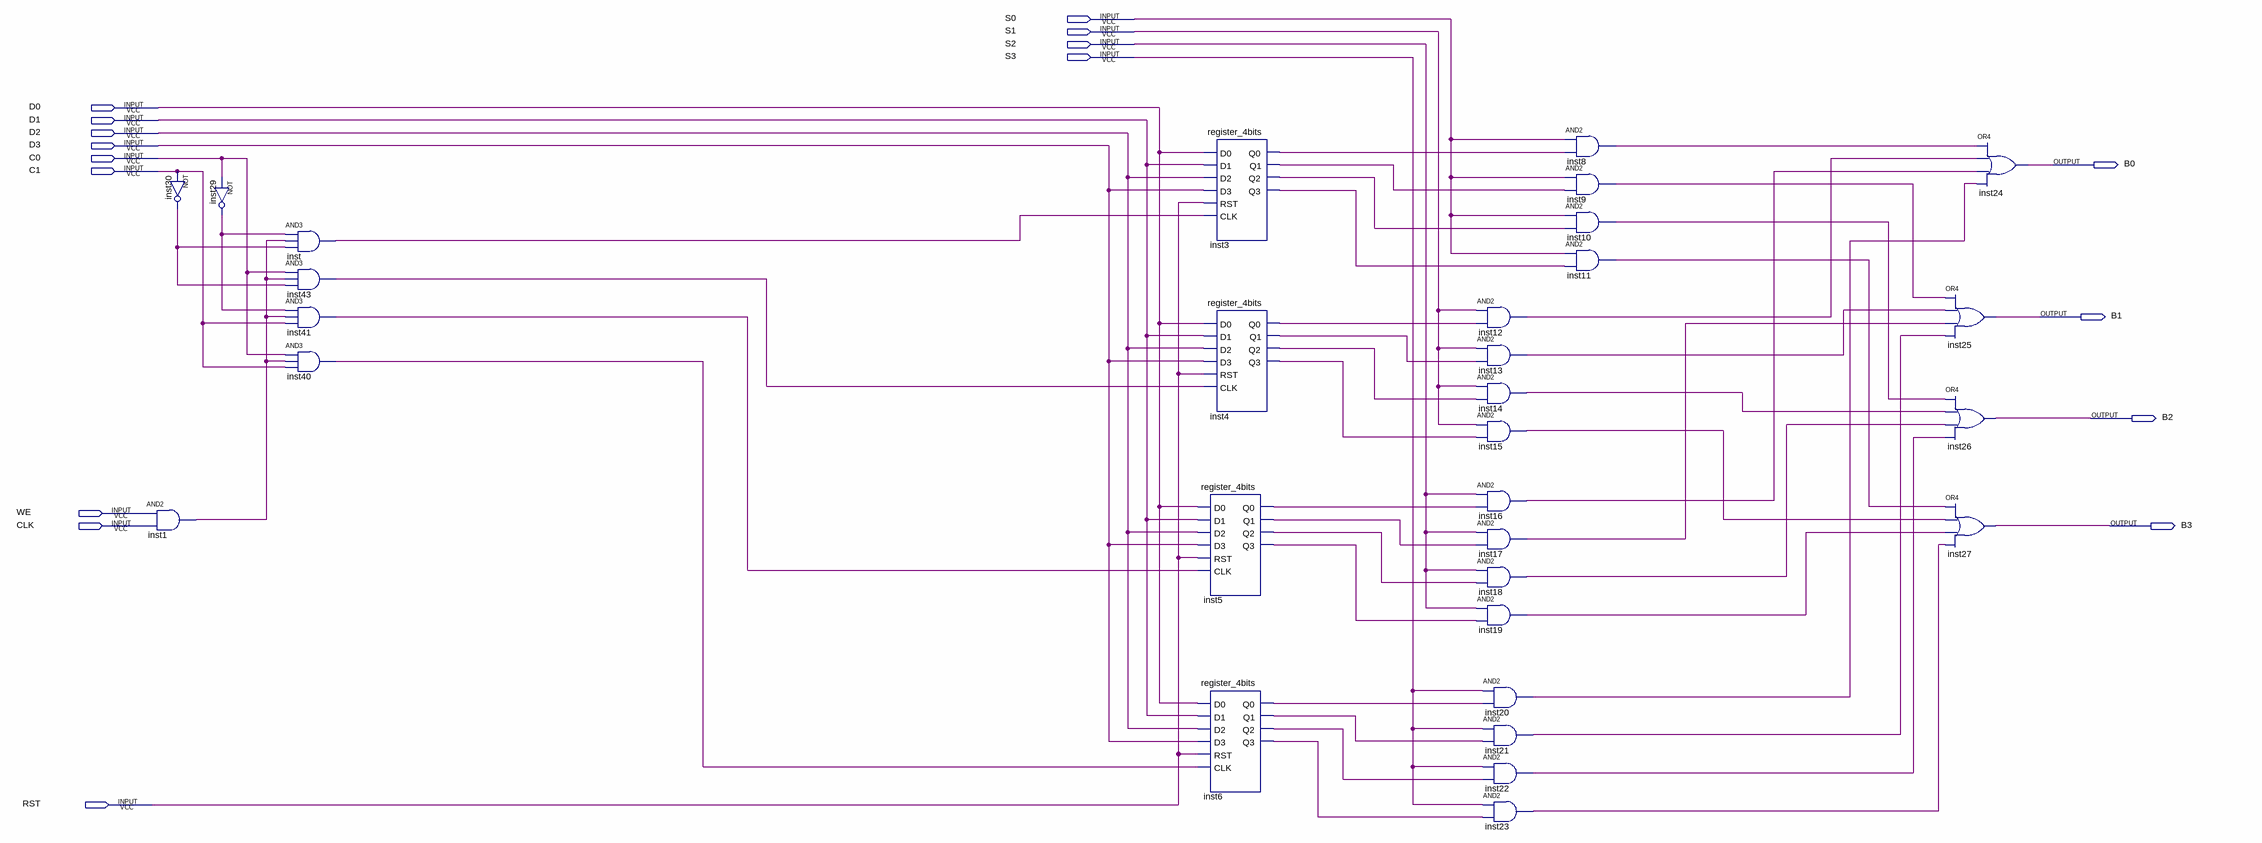
[diagram p0: schematic sheet]
// Quartus schematic register_bank.bdf as structural Verilog: 31 symbols, 17 pins
module register_bank (
  input  S0,
  input  S1,
  input  S2,
  input  S3,
  input  D0,
  input  D1,
  input  D2,
  input  D3,
  input  C0,
  input  C1,
  input  WE,
  input  CLK,
  input  RST,
  output B0,
  output B1,
  output B2,
  output B3
);

  wire inst1_out, inst3_q0, inst3_q1, inst3_q2, inst3_q3, inst4_q0, inst4_q1, inst4_q2, inst4_q3, inst5_q0,
       inst5_q1, inst5_q2, inst5_q3, inst6_q0, inst6_q1, inst6_q2, inst6_q3, inst8_out, inst9_out,
       inst10_out, inst11_out, inst12_out, inst13_out, inst14_out, inst15_out, inst16_out, inst17_out,
       inst18_out, inst19_out, inst20_out, inst21_out, inst22_out, inst23_out, inst29_out, inst30_out,
       inst40_out, inst41_out, inst43_out, inst_out;

  not inst30 (inst30_out, C1);
  and inst1 (inst1_out, WE, CLK);
  not inst29 (inst29_out, C0);
  and inst (inst_out, inst29_out, inst1_out, inst30_out);
  and inst43 (inst43_out, C0, inst1_out, inst30_out);
  and inst41 (inst41_out, inst29_out, inst1_out, C1);
  and inst40 (inst40_out, C0, inst1_out, C1);
  register_4bits inst3 (
    .D0(D0), .D1(D1), .D2(D2), .D3(D3), .RST(RST), .CLK(inst_out), .Q0(inst3_q0), .Q1(inst3_q1),
    .Q2(inst3_q2), .Q3(inst3_q3));
  register_4bits inst4 (
    .D0(D0), .D1(D1), .D2(D2), .D3(D3), .RST(RST), .CLK(inst43_out), .Q0(inst4_q0), .Q1(inst4_q1),
    .Q2(inst4_q2), .Q3(inst4_q3));
  register_4bits inst5 (
    .D0(D0), .D1(D1), .D2(D2), .D3(D3), .RST(RST), .CLK(inst41_out), .Q0(inst5_q0), .Q1(inst5_q1),
    .Q2(inst5_q2), .Q3(inst5_q3));
  register_4bits inst6 (
    .D0(D0), .D1(D1), .D2(D2), .D3(D3), .RST(RST), .CLK(inst40_out), .Q0(inst6_q0), .Q1(inst6_q1),
    .Q2(inst6_q2), .Q3(inst6_q3));
  and inst12 (inst12_out, S1, inst4_q0);
  and inst13 (inst13_out, S1, inst4_q1);
  and inst14 (inst14_out, S1, inst4_q2);
  and inst15 (inst15_out, S1, inst4_q3);
  and inst16 (inst16_out, S2, inst5_q0);
  and inst17 (inst17_out, S2, inst5_q1);
  and inst18 (inst18_out, S2, inst5_q2);
  and inst19 (inst19_out, S2, inst5_q3);
  and inst20 (inst20_out, S3, inst6_q0);
  and inst21 (inst21_out, S3, inst6_q1);
  and inst22 (inst22_out, S3, inst6_q2);
  and inst23 (inst23_out, S3, inst6_q3);
  and inst8 (inst8_out, S0, inst3_q0);
  and inst9 (inst9_out, S0, inst3_q1);
  and inst10 (inst10_out, S0, inst3_q2);
  and inst11 (inst11_out, S0, inst3_q3);
  or inst25 (B1, inst9_out, inst13_out, inst17_out, inst21_out);
  or inst26 (B2, inst10_out, inst14_out, inst18_out, inst22_out);
  or inst27 (B3, inst11_out, inst15_out, inst19_out, inst23_out);
  or inst24 (B0, inst8_out, inst12_out, inst16_out, inst20_out);
endmodule
